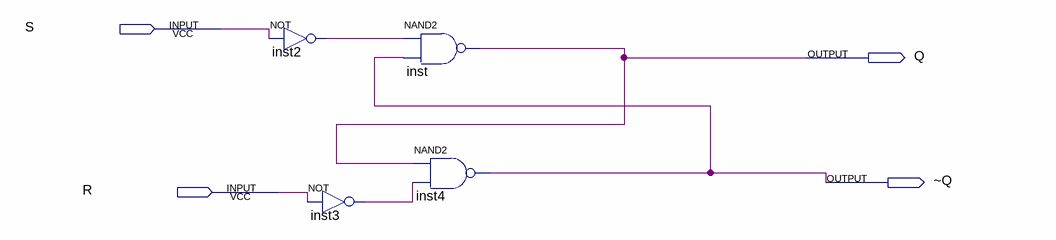
[diagram p0: schematic sheet]
// Quartus schematic lab9step2.bdf as structural Verilog: 4 symbols, 4 pins
module lab9step2 (
  input  S,
  input  R,
  output Q,
  output \~Q 
);

  wire inst2_out, inst3_out;

  not inst2 (inst2_out, S);
  not inst3 (inst3_out, R);
  nand inst (Q, inst2_out, \~Q );
  nand inst4 (\~Q , Q, inst3_out);
endmodule
